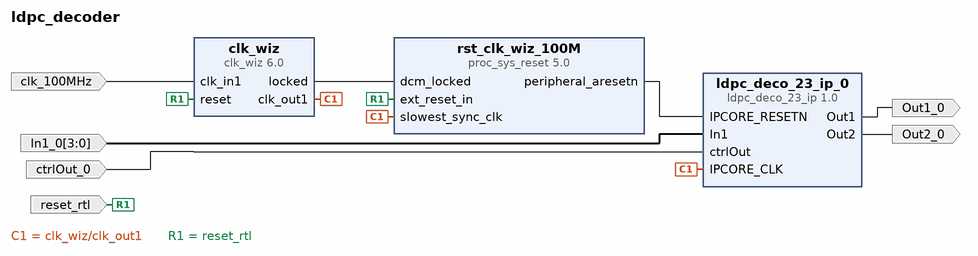
[diagram p0: block diagram of the top level]
# Vivado block design ldpc_decoder, xc7z010clg400-1, Vivado 2023.2
create_bd_design ldpc_decoder

create_bd_port -dir I -type clk clk_100MHz
set_property -dict {CONFIG.FREQ_HZ 125000000} [get_bd_ports clk_100MHz]
create_bd_port -dir I -type rst reset_rtl
set_property -dict {CONFIG.POLARITY ACTIVE_HIGH} [get_bd_ports reset_rtl]
create_bd_port -dir I -from 3 -to 0 In1_0
create_bd_port -dir O Out1_0
create_bd_port -dir O Out2_0
create_bd_port -dir I ctrlOut_0

create_bd_cell -type ip -vlnv user.org:ip:ldpc_deco_23_ip:1.0 ldpc_deco_23_ip_0
create_bd_cell -type ip -vlnv xilinx.com:ip:clk_wiz:6.0 clk_wiz
set_property -dict [list \
  CONFIG.CLKIN1_JITTER_PS 80.0 \
  CONFIG.CLKOUT1_JITTER 119.348 \
  CONFIG.CLKOUT1_PHASE_ERROR 96.948 \
  CONFIG.CLKOUT1_REQUESTED_OUT_FREQ 125.000 \
  CONFIG.MMCM_CLKFBOUT_MULT_F 8.000 \
  CONFIG.MMCM_CLKIN1_PERIOD 8.000 \
  CONFIG.MMCM_CLKOUT0_DIVIDE_F 8.000 \
  CONFIG.PRIM_IN_FREQ 125.000 \
] [get_bd_cells clk_wiz]
create_bd_cell -type ip -vlnv xilinx.com:ip:proc_sys_reset:5.0 rst_clk_wiz_100M

# ---- connections ----

connect_bd_net -net In1_0_1 [get_bd_ports In1_0] [get_bd_pins ldpc_deco_23_ip_0/In1]
connect_bd_net [get_bd_ports clk_100MHz] [get_bd_pins clk_wiz/clk_in1]
connect_bd_net [get_bd_pins clk_wiz/clk_out1] [get_bd_pins rst_clk_wiz_100M/slowest_sync_clk] [get_bd_pins ldpc_deco_23_ip_0/IPCORE_CLK]
connect_bd_net [get_bd_pins clk_wiz/locked] [get_bd_pins rst_clk_wiz_100M/dcm_locked]
connect_bd_net -net ctrlOut_0_1 [get_bd_ports ctrlOut_0] [get_bd_pins ldpc_deco_23_ip_0/ctrlOut]
connect_bd_net [get_bd_pins ldpc_deco_23_ip_0/Out1] [get_bd_ports Out1_0]
connect_bd_net [get_bd_pins ldpc_deco_23_ip_0/Out2] [get_bd_ports Out2_0]
connect_bd_net [get_bd_ports reset_rtl] [get_bd_pins clk_wiz/reset] [get_bd_pins rst_clk_wiz_100M/ext_reset_in]
connect_bd_net [get_bd_pins rst_clk_wiz_100M/peripheral_aresetn] [get_bd_pins ldpc_deco_23_ip_0/IPCORE_RESETN]

validate_bd_design
save_bd_design
